# Altium project ControllerIntermediateInterface.PrjPcb
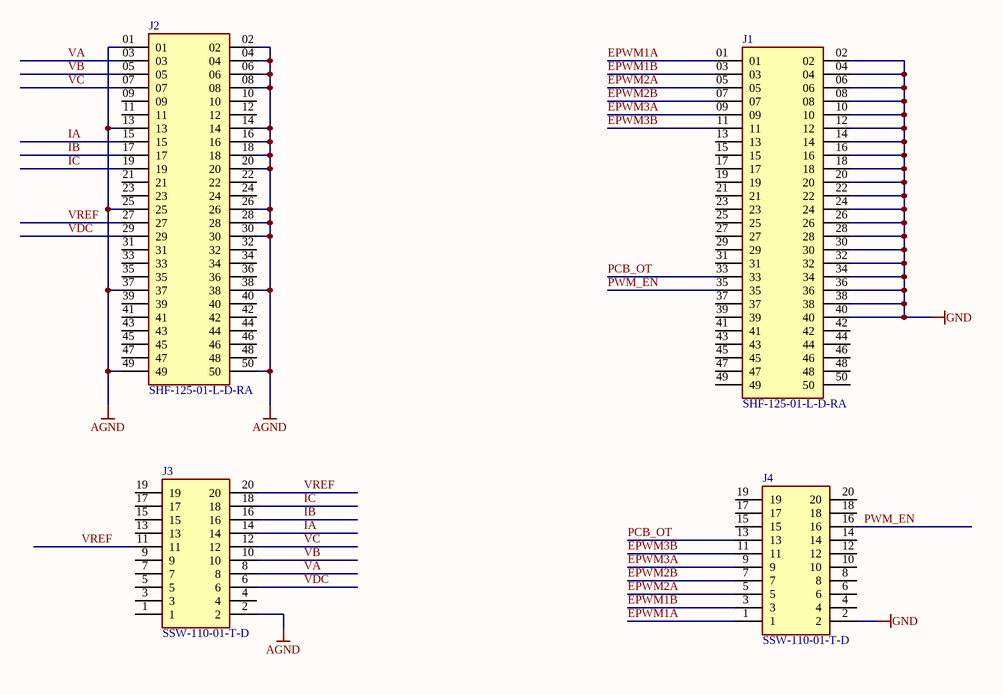
[diagram p0: TopLevelBoard.SchDoc]
1 sheet, 4 parts. Net scope: global (net labels, ports and power ports of the same name join across sheets).
Board file: ControllerIntermediatePCB.PcbDoc

## Sheet TopLevelBoard.SchDoc: Controller Interface Board
size A4; DrawnBy: Yan To Chau; SheetNumber: 1; SheetTotal: 1

### Parts
J1  SHF-125-01-L-D-RA  [SAMTEC_SHF-125-01-L-D-RA]
J2  SHF-125-01-L-D-RA  [SAMTEC_SHF-125-01-L-D-RA]
J3  SSW-110-01-T-D  [SAMTEC_SSW-110-01-T-D]
J4  SSW-110-01-T-D  [SAMTEC_SSW-110-01-T-D]

### Nets
AGND: J2.01 J2.02 J2.04 J2.06 J2.08 J2.13 J2.14 J2.16 J2.18 J2.20 J2.25 J2.26 J2.28 J2.30 J2.37 J2.38 J2.49 J2.50 J3.2
GND: J1.02 J1.04 J1.06 J1.08 J1.10 J1.12 J1.14 J1.16 J1.18 J1.20 J1.22 J1.24 J1.26 J1.28 J1.30 J1.32 J1.34 J1.36 J1.38 J1.40 J4.2
EPWM1A: J1.01 J4.1
EPWM1B: J1.03 J4.3
EPWM2A: J1.05 J4.5
EPWM2B: J1.07 J4.7
EPWM3A: J1.09 J4.9
EPWM3B: J1.11 J4.11
IA: J2.15 J3.14
IB: J2.17 J3.16
IC: J2.19 J3.18
PCB_OT: J1.33 J4.13
PWM_EN: J1.35 J4.16
VA: J2.03 J3.8
VB: J2.05 J3.10
VC: J2.07 J3.12
VDC: J2.29 J3.6
VREF: J2.27 J3.11 J3.20

Not connected (* = marked no-connect by the designer): J1 13 15 17 19 21 23 25 27 29 31 37 39 41 42 43 44 45 46 47 48 49 50; J2 09 10 11 12 21 22 23 24 31 32 33 34 35 36 39 40 41 42 43 44 45 46 47 48; J3 1 3 4 5 7 9 13 15 17 19; J4 4 6 8 10 12 14 15 17 18 19 20

### Library data of the parts
J1 J2 = SHF-125-01-L-D-RA: MF: Samtec; MP: SHF-125-01-L-D-RA; Package: None; Price: None; Availability: Unavailable; Value: *
J3 J4 = SSW-110-01-T-D: Connector; Manufacturer_Name: SAMTEC; Datasheet Link: http://suddendocs.samtec.com/prints/ssw-1xx-xx-xxx-x-xx-xxx-xx-mkt.pdf; Manufacturer_Part_Number: SSW-110-01-T-D; Mouser Part Number: 200-SSW11001TD; Mouser Price/Stock: https://www.mouser.co.uk/ProductDetail/Samtec/SSW-110-01-T-D?qs=rkdpAy2aP%2F9uJOQW5acCOw%3D%3D; Arrow Part Number: SSW-110-01-T-D; Arrow Price/Stock: https://www.arrow.com/en/products/ssw-110-01-t-d/samtec?region=nac